# EAGLE design c64tape (EAGLE 5.02)
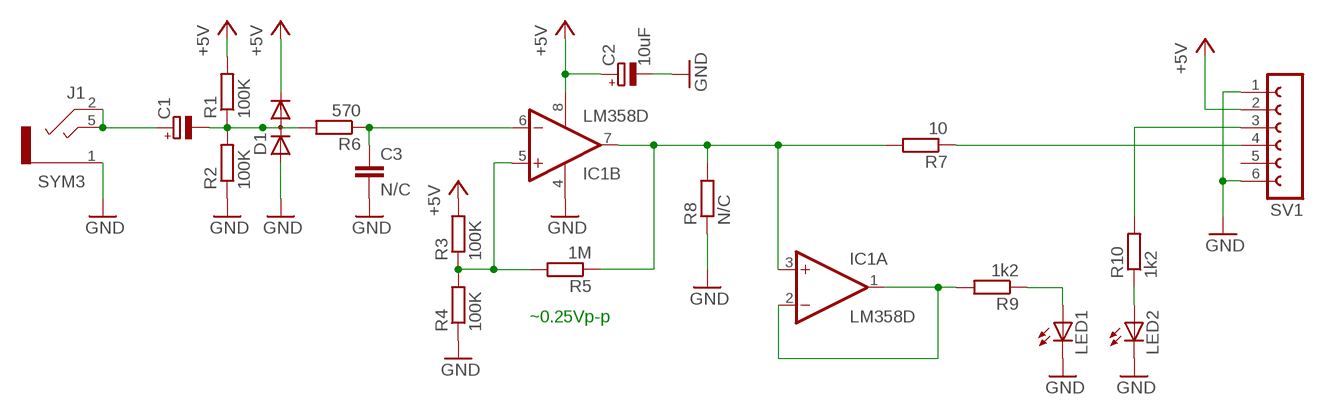
[diagram p0: schematic, sheet 1]

## Parts
C1  CPOL-EUB/3528-21R  [B/3528-21R]
C2  10uF  CPOL-EUB/3528-21R  [B/3528-21R]
C3  N/C  C-EUC0805K  [C0805K]
D1  DIODE_2CACA-SOT23  [SOT23]
IC1  LM358D  [SO08]
J1  SYM3  [SYMMETRON3]
LED1  LEDCHIP-LED0805  [CHIP-LED0805]
LED2  LEDCHIP-LED0805  [CHIP-LED0805]
R1  100K  R-EU_R0805  [R0805]
R2  100K  R-EU_R0805  [R0805]
R3  100K  R-EU_R0805  [R0805]
R4  100K  R-EU_R0805  [R0805]
R5  1M  R-EU_R0805  [R0805]
R6  570  R-EU_R0805  [R0805]
R7  10  R-EU_R0805  [R0805]
R8  N/C  R-EU_R0805  [R0805]
R9  1k2  R-EU_R0805  [R0805]
R10  1k2  R-EU_R0805  [R0805]
SV1  FE06-1  [FE06]

## Nets
+5V: C2.+ D1.2(C) IC1.8(P:V+) R1.2 R3.2 SV1.2
GND: C2.- C3.2 D1.1(A) IC1.4(P:V-) J1.1 LED1.C LED2.C R2.1 R4.1 R8.1 SV1.1 SV1.6
N$1: C1.+ J1.2 J1.5
N$2: C3.1 IC1.6(B:-IN) R6.1
N$3: IC1.5(B:+IN) R3.1 R4.2 R5.2
N$4: IC1.3(A:+IN) IC1.7(B:OUT) R5.1 R7.2 R8.2
N$5: R10.2 SV1.3
N$6: LED1.A R9.1
N$7: LED2.A R10.1
N$8: R7.1 SV1.4
N$9: IC1.1(A:OUT) IC1.2(A:-IN) R9.2
N$11: C1.- D1.3(AC) R1.1 R2.2 R6.2
Unconnected: SV1.5

## Notes on the sheet
- ~0.25Vp-p

## Library data of the parts
C1 C2 = rcl:CPOL-EU: POLARIZED CAPACITOR, European symbol
C3 = rcl:C-EU: CAPACITOR, European symbol
D1 = diode:DIODE_2CACA-: 2 Diodes - Cathode-Anode|Cathode-Anode
IC1 = linear:LM358: OP AMP also LM158; LM258; LM2904 Source: http://cache.national.com/ds/LM/LM158.pdf
J1 = 0-svo-jacks:SYM3
LED1 LED2 = led:LED: LED OSRAM: - CHIPLED LG R971, LG N971, LY N971, LG Q971, LY Q971, LO R971, LY R971 LH N974, LH R974 LS Q976, LO Q976, LY Q976 LO Q996 - Hyper CHIPLED LW Q18S LB Q993, LB Q99A, LB R99A - SideLED LS A670, LO A670, LY A670, LG A670, LP A670 LB A673, LV A673, LT A673, LW A673 LH A674 LY A675 LS A676, LA A676, LO A676, LY A676, LW A676 LS A679, LY A679, LG A679 - Hyper Micro SIDELED® LS Y876, LA Y876, LO Y876, LY Y876 LT Y87S - SmartLED LW L88C, LW L88S LB L89C, LB L89S, LG L890 LS L89K, LO L89K, LY L89K LS L896, LA L896, LO L896, LY L896 - TOPLED LS T670, LO T670, LY T670, LG T670, LP T670 LSG T670, LSP T670, LSY T670, LOP T670, LYG T670 LG T671, LOG T671, LSG T671 LB T673, LV T673, LT T673, LW T673 LH T674 LS T676, LA T676, LO T676, LY T676, LB T676, LH T676, LSB T676, LW T676 LB T67C, LV T67C, LT T67C, LS T67K, LO T67K, LY T67K, LW E67C LS E67B, LA E67B, LO E67B, LY E67B, LB E67C, LV E67C, LT E67C LW T67C LS T679, LY T679, LG T679 LS T770, LO T770, LY T770, LG T770, LP T770 LB T773, LV T773, LT T773, LW T773 LH T774 LS E675, LA E675, LY E675, LS T675 LS T776, LA T776, LO T776, LY T776, LB T776 LHGB T686 LT T68C, LB T68C - Hyper Mini TOPLED® LB M676 - Mini TOPLED Santana® LG M470 LS M47K, LO M47K, LY M47K Source: http://www.osram.convergy.de - LUMILED® LXK2-PW12-R00, LXK2-PW12-S00, LXK2-PW14-U00, LXK2-PW14-V00 LXK2-PM12-R00, LXK2-PM12-S00, LXK2-PM14-U00 LXK2-PE12-Q00, LXK2-PE12-R00, LXK2-PE12-S00, LXK2-PE14-T00, LXK2-PE14-U00 LXK2-PB12-K00, LXK2-PB12-L00, LXK2-PB12-M00, LXK2-PB14-N00, LXK2-PB14-P00, LXK2-PB14-Q00 LXK2-PR12-L00, LXK2-PR12-M00, LXK2-PR14-Q00, LXK2-PR14-R00 LXK2-PD12-Q00, LXK2-PD12-R00, LXK2-PD12-S00 LXK2-PH12-R00, LXK2-PH12-S00 LXK2-PL12-P00, LXK2-PL12-Q00, LXK2-PL12-R00 Source: www.luxeon.com
R1-R10 = rcl:R-EU_: RESISTOR, European symbol
SV1 = con-lsta:FE06-1: FEMALE HEADER

## Net classes
0 default: width 0.508 mm

## Board
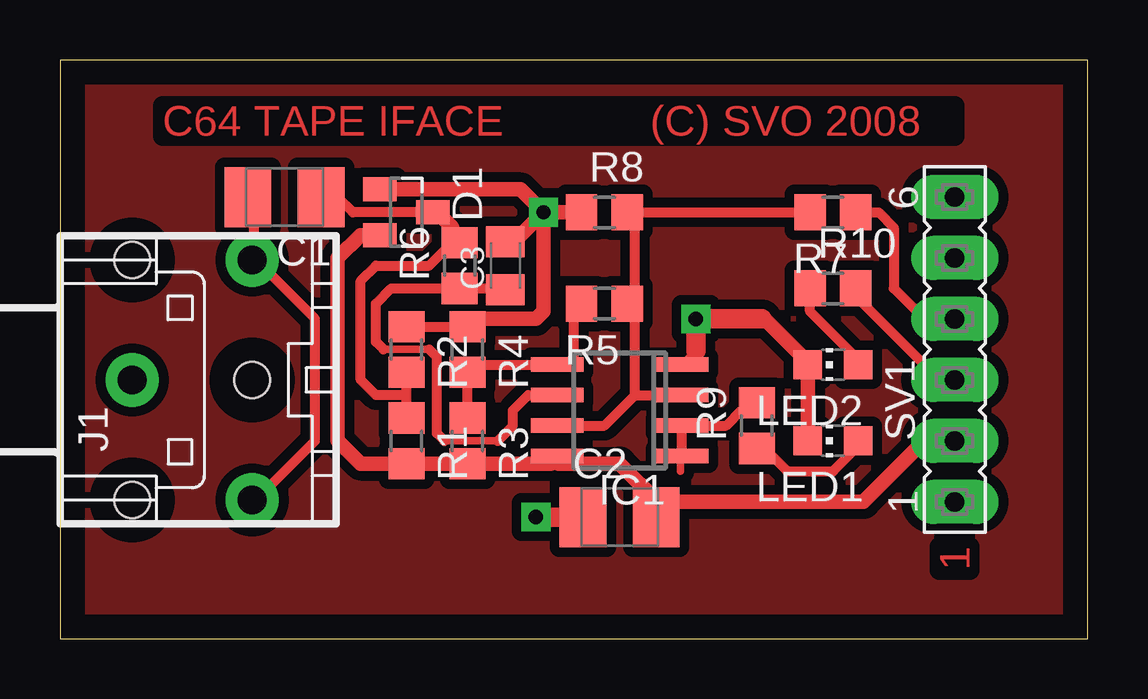
[diagram p1: board, top side]
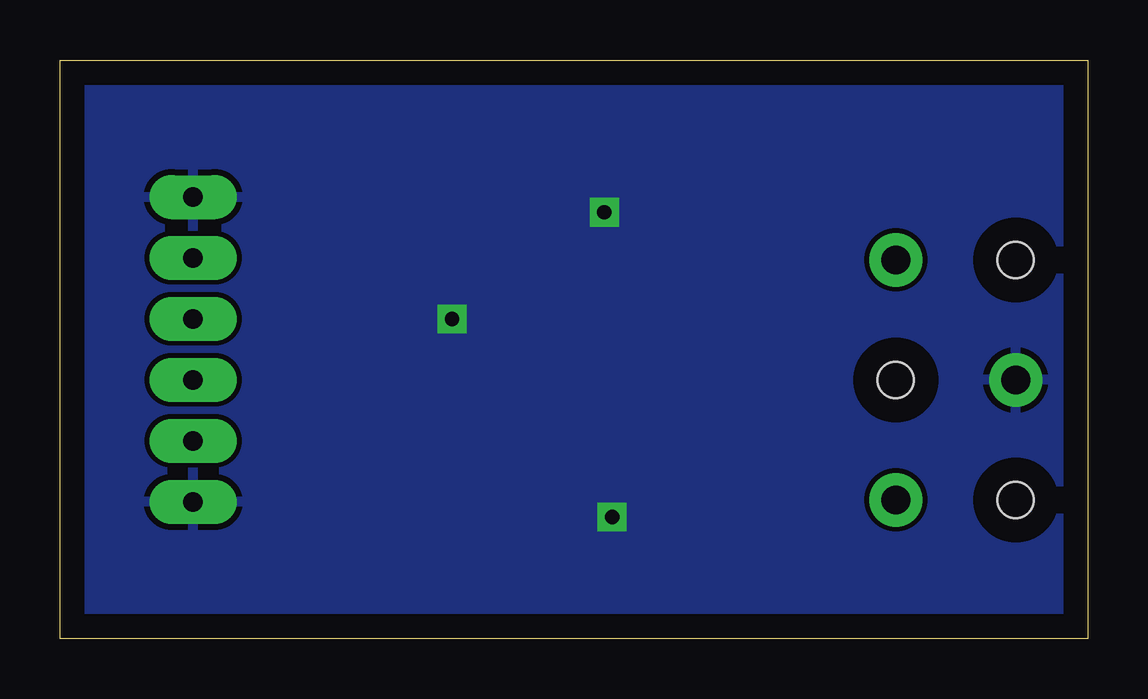
[diagram p2: board, bottom side, seen from below]

Size 42.85 x 24.12 mm. Coordinates in mm from the lower left corner, seen from the top.
Outline: 0,0 42.85,0 42.85,24.12 0,24.12 0,0
Copper layers (1*16): Top 0.035mm / dielectric 1.5mm / Bottom 0.035mm
Design rules "default *": minimum track width 10mil, minimum drill 24mil, track to track 8mil, track to pad 8mil, pad to pad 8mil, via to via 8mil, smd to smd 8mil, copper to edge 40mil, drill to drill 8mil, minimum pad ring 10mil, minimum via ring 8mil, stop-mask expansion 4mil, vias tented up to drill 0mil, thermal gap 10mil
tRestrict: area 4.3,20.9 to 37.3,22.2

### Footprints (pad centres in the part's own frame; a part is rotated, then mirrored left to right if it is on the bottom)
B/3528-21R = smd 1.95 x 2.5: + 1.525,0; - -1.525,0
C0805K = smd 1.3 x 1.6: 1 -1,0; 2 1,0
SOT23 = smd 1 x 1.4: 1 -0.95,-1.1; 2 0.95,-1.1; 3 0,1.1
SO08 = smd 0.6 x 2.2: 1 -1.905,-2.6; 2 -0.635,-2.6; 3 0.635,-2.6; 4 1.905,-2.6; 5 1.905,2.6; 6 0.635,2.6; 7 -0.635,2.6; 8 -1.905,2.6
SYMMETRON3 = drill 1.2 round: 1 0,0; 2 5,5; 5 5,-5 | hole 1.5: 0,-5; 5,0; 0,5
CHIP-LED0805 = smd 1.2 x 1.2: A 0,-1.05; C 0,1.05
R0805 = smd 1.3 x 1.5: 1 -0.95,0; 2 0.95,0
FE06 = drill 0.813 long: 1 -6.35,0; 2 -3.81,0; 3 -1.27,0; 4 1.27,0; 5 3.81,0; 6 6.35,0

### Placement (x,y rotation side)
C1  9.36,18.41 180 top
C2  23.33,5.08 0 top
C3  18.57,15.55 90 top
D1  14.44,17.77 270 top
IC1  23.33,9.52 90 top
J1  3.01,10.79 0 top
LED1  32.22,8.25 90 top
LED2  32.22,11.43 90 top
R1  14.44,8.25 270 top
R2  14.44,12.06 270 top
R3  16.98,8.25 270 top
R4  16.98,12.06 270 top
R5  22.7,13.97 180 top
R6  16.66,15.55 90 top
R7  32.22,17.77 180 top
R8  22.7,17.77 0 top
R9  29.04,8.89 90 top
R10  32.22,14.6 0 top
SV1  37.3,12.06 90 top

### Tracks (layer width: path | path; a pad name or v marks a point on that pad's centre or on a via)
+5V
  Top 0.406: R3.2 16.98,7.62 16.66,7.3 | 20.79,7.62 IC1.8 | D1.2 13.34,16.68
  Top 0.61: 16.66,7.3 R1.2 12.53,7.3 11.58,8.25 11.58,15.87 12.54,16.82 13.17,16.82 | R3.2 20.47,7.3 20.79,7.62 | 36.03,8.25 33.49,5.71 24.92,5.71 23.33,7.3 20.79,7.3 20.73,7.36 IC1.8
  Top 0.813: 36.03,8.25 SV1.2 | 13.17,16.82 D1.2 | C2.+ 24.86,5.33 24.92,5.39 24.92,5.71
GND  (via drill 0.6)
  Top 0.306: IC1.4 26.5,12 | 16.98,12.7 17.61,13.33
  Top 0.406: R2.1 16.66,13.01 16.98,12.7 R4.1
  Top 0.61: v20.15,17.77 R8.1 | 17.61,13.33 19.84,13.33 20.15,13.65 v20.15,17.77 | C3.2 18.93,16.55 v20.15,17.77 | D1.1 19.2,18.72 v20.15,17.77 | 29.27,13.33 29.36,13.33 31.17,11.52 LED2.C 31.27,11.43 31.17,11.33 LED1.C
  Top 0.813: 26.5,12 v26.5,13.33 29.27,13.33 | D1.1 13.49,18.72 | v19.84,5.08 C2.-
  pour Bottom: -5.88,83.18 102.07,83.18 102.07,-5.72 -5.88,-5.72 -5.88,-3.18
N$1
  Top 0.406: J1.5 8.17,5.79 10.63,8.25 10.63,13.33 8.09,15.87 | 8.09,15.87 J1.2 | C1.+ 8.09,18.41 8.09,15.87
N$2
  Top 0.305: 15.39,12.06 13.49,12.06 | 16.03,8.25 18.25,8.25
  Top 0.406: IC1.6 19.52,10.16 18.88,9.52 18.88,8.89 18.25,8.25 | 13.49,12.06 13.17,12.38 13.17,13.97 13.81,14.6 R6.1 18.56,14.6 18.57,14.6 C3.1 | 15.39,12.06 15.71,11.74 15.71,8.57 16.03,8.25
N$3
  Top 0.406: IC1.5 17.61,11.43 16.98,10.79 | 16.98,10.79 R4.2 | R3.1 16.98,10.79 | R5.2 21.42,13.97 21.42,11.74 21.11,11.43 IC1.5 | IC1.5 20.79,11.43
N$4
  Top 0.406: IC1.7 22.7,8.89 23.96,10.16 | 23.96,10.16 IC1.3 | 23.96,10.16 23.96,13.97 R5.1 23.96,14.29 23.96,17.14 R8.2 R7.2 31.58,17.77
N$5
  Top 0.406: R10.2 33.17,14.29 36.66,10.79 SV1.3
N$6
  Top 0.406: R9.1 29.36,7.93 30.31,6.98 32.22,6.98 33.49,8.25 LED1.A
N$7
  Top 0.406: LED2.A 33.27,11.65 31.27,13.65 R10.1
N$8
  Top 0.406: SV1.4 36.03,13.33 34.76,14.6 34.76,17.14 34.12,17.77 R7.1
N$9
  Top 0.306: 25.87,7.62 25.87,6.98
  Top 0.406: R9.2 29.04,9.52 28.41,9.52 27.77,8.89 IC1.2 25.87,8.89 25.93,8.83 IC1.1 25.87,7.62
N$10
  pour Top (isolate 0.406): 0.47,24.76 0.47,-0.64 43.65,-0.64 43.65,24.76
N$11
  Top 0.406: C1.- 11.58,18.41 12.22,17.77 D1.3 | R1.1 14.44,10.16 | 14.44,10.16 R2.2 | R6.2 16.34,16.5 15.39,15.55 13.17,15.55 12.54,14.92 12.54,10.79 13.17,10.16 14.44,10.16
  Top 0.61: D1.3 15.71,17.77 16.34,17.14 16.34,16.5

### Text on the board
Top: C64 TAPE IFACE | (C) SVO 2008 | 1